# EAGLE design Lamp Logic Board_3 (EAGLE 9.4.2)

## Sheet 1 of 4
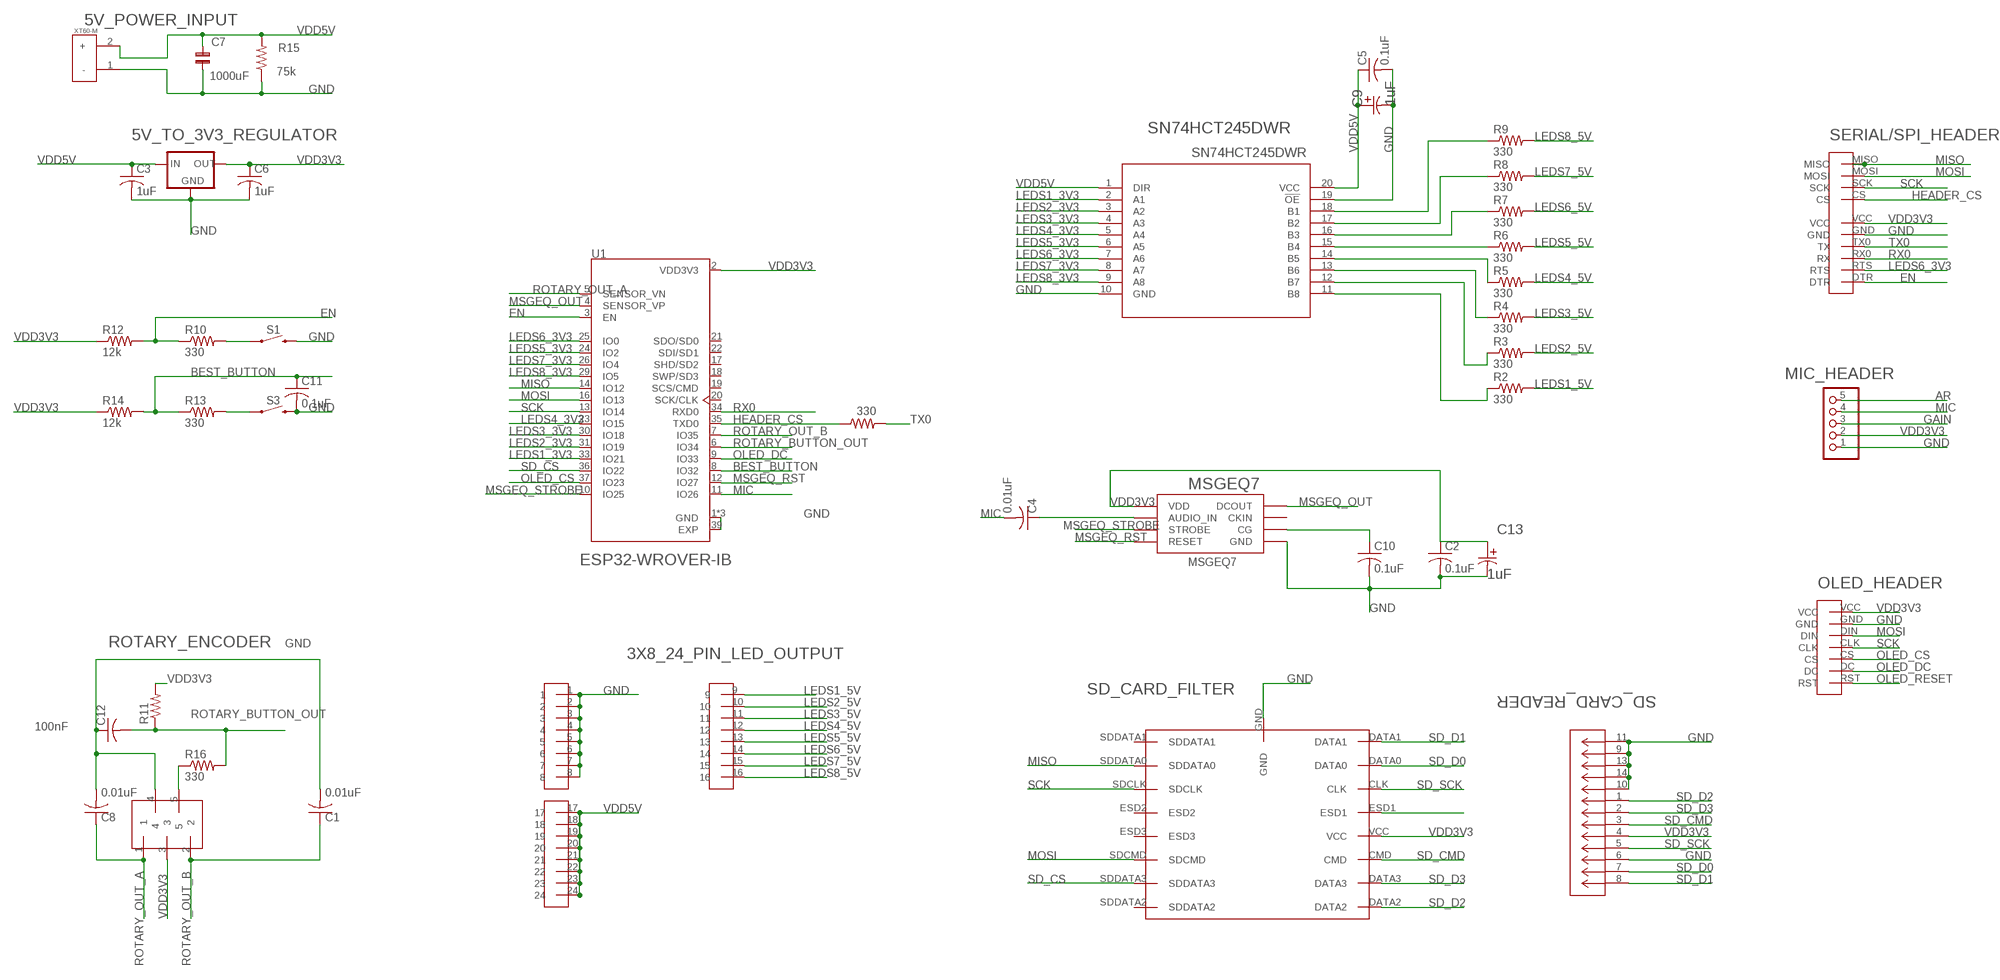
[diagram p0: schematic, sheet 1]

### Parts
3X8_24_PIN_LED_OUTPUT  3X8PINHEAD  [3X8PINHEAD]
5V_POWER_INPUT  XT60-M  [AMASS_XT60-M]
5V_TO_3V3_REGULATOR  LM1117MP-1.8  [SOT223]
C1  0.01uF  C-USC0402  [C0402]
C2  0.1uF  C-USC0805  [C0805]
C3  1uF  C-USC0402  [C0402]
C4  0.01uF  C-USC0402  [C0402]
C5  0.1uF  C-USC0805  [C0805]
C6  1uF  C-USC0402  [C0402]
C7  1000uF  C-BP-2,0X5  [ENP2,0-5]
C8  0.01uF  C-USC0402  [C0402]
C9  1uF  EEEFC1V1R0R  [CAP_EEFC_B]
C10  0.1uF  C-USC0805  [C0805]
C11  0.1uF  C-USC0805  [C0805]
C12  100nF  C-USC0402  [C0402]
C13  1uF  EEEFC1V1R0R  [CAP_EEFC_B]
MIC_HEADER  PINHD-1X5  [1X05]
MSGEQ7  MSGEQ7DIL  [DIL-08]
OLED_HEADER  SPIOLED_STANDOFF  [SPIOLED_STADOFF]
R1  330  R-US_R1206  [R1206]
R2  330  R-US_R1206  [R1206]
R3  330  R-US_R1206  [R1206]
R4  330  R-US_R1206  [R1206]
R5  330  R-US_R1206  [R1206]
R6  330  R-US_R1206  [R1206]
R7  330  R-US_R1206  [R1206]
R8  330  R-US_R1206  [R1206]
R9  330  R-US_R1206  [R1206]
R10  330  R-US_R1206  [R1206]
R11  R-US_R0603  [R0603]
R12  12k  R-US_R0603  [R0603]
R13  330  R-US_R1206  [R1206]
R14  12k  R-US_R0603  [R0603]
R15  75k  R-US_0309/12  [0309/12]
R16  330  R-US_R1206  [R1206]
ROTARY_ENCODER  EN11-HSM1AF15  [EN11-HSM]
S1  MOMENTARY-SWITCH-SPST-SMD-6.0X3.5MM  [TACTILE_SWITCH_SMD_6.0X3.5MM]
S3  MOMENTARY-SWITCH-SPST-SMD-12MM  [TACTILE_SWITCH_SMD_12MM]
SD_CARD_FILTER  CM1624-08DE  [CM1624-08DE]
SD_CARD_READER  LLC  [CON00218_8]
SERIAL/SPI_HEADER  2X6PINHEAD  [2X6PINHEAD]
SN74HCT245DWR  SN74HCT245DWR  [DW20]
U1  ESP32-WROVER-IB  ESP32-WROVER-I  [XCVR_ESP32-WROVER-I]

### Nets
AR: MIC_HEADER.5
BEST_BUTTON: C11.1 R13.1 R14.2 U1.8(IO32)
EN: R10.1 R12.2 SERIAL/SPI_HEADER.DTR U1.3(EN)
GAIN: MIC_HEADER.3
GND: 3X8_24_PIN_LED_OUTPUT.1 3X8_24_PIN_LED_OUTPUT.2 3X8_24_PIN_LED_OUTPUT.3 3X8_24_PIN_LED_OUTPUT.4 3X8_24_PIN_LED_OUTPUT.5 3X8_24_PIN_LED_OUTPUT.6 3X8_24_PIN_LED_OUTPUT.7 3X8_24_PIN_LED_OUTPUT.8 5V_POWER_INPUT.1(-) 5V_TO_3V3_REGULATOR.1(GND) C1.2 C2.2 C3.2 C5.2 C6.2 C7.1 C8.2 C9.2 C10.2 C11.2 C12.1 C13.2 MIC_HEADER.1 MSGEQ7.2(GND) OLED_HEADER.GND R15.1 ROTARY_ENCODER.4 S1.2 S3.3 SD_CARD_FILTER.GND SD_CARD_READER.6 SD_CARD_READER.9 SD_CARD_READER.10 SD_CARD_READER.11 SD_CARD_READER.13 SD_CARD_READER.14 SERIAL/SPI_HEADER.GND SN74HCT245DWR.10(GND) SN74HCT245DWR.19(!OE) U1.1(GND) U1.15(GND) U1.38(GND) U1.39(EXP)
HEADER_CS: R1.1 SERIAL/SPI_HEADER.CS U1.35(TXD0)
LEDS1_3V3: SN74HCT245DWR.2(A1) U1.33(IO21)
LEDS1_5V: 3X8_24_PIN_LED_OUTPUT.9 R2.2
LEDS2_3V3: SN74HCT245DWR.3(A2) U1.31(IO19)
LEDS2_5V: 3X8_24_PIN_LED_OUTPUT.10 R3.2
LEDS3_3V3: SN74HCT245DWR.4(A3) U1.30(IO18)
LEDS3_5V: 3X8_24_PIN_LED_OUTPUT.11 R4.2
LEDS4_3V3: SN74HCT245DWR.5(A4) U1.23(IO15)
LEDS4_5V: 3X8_24_PIN_LED_OUTPUT.12 R5.2
LEDS5_3V3: SN74HCT245DWR.6(A5) U1.24(IO2)
LEDS5_5V: 3X8_24_PIN_LED_OUTPUT.13 R6.2
LEDS6_3V3: SERIAL/SPI_HEADER.RTS SN74HCT245DWR.7(A6) U1.25(IO0)
LEDS6_5V: 3X8_24_PIN_LED_OUTPUT.14 R7.2
LEDS7_3V3: SN74HCT245DWR.8(A7) U1.26(IO4)
LEDS7_5V: 3X8_24_PIN_LED_OUTPUT.15 R8.2
LEDS8_3V3: SN74HCT245DWR.9(A8) U1.29(IO5)
LEDS8_5V: 3X8_24_PIN_LED_OUTPUT.16 R9.2
MIC: C4.2 MIC_HEADER.4 U1.11(IO26)
MISO: SD_CARD_FILTER.SDDATA0 SERIAL/SPI_HEADER.MISO U1.14(IO12)
MOSI: OLED_HEADER.DIN SD_CARD_FILTER.SDCMD SERIAL/SPI_HEADER.MOSI U1.16(IO13)
MSGEQ_OUT: MSGEQ7.3(DCOUT) U1.4(SENSOR_VP)
MSGEQ_RST: MSGEQ7.7(RESET) U1.12(IO27)
MSGEQ_STROBE: MSGEQ7.4(STROBE) U1.10(IO25)
N$1: R9.1 SN74HCT245DWR.18(B1)
N$3: C4.1 MSGEQ7.5(AUDIO_IN)
N$4: C10.1 MSGEQ7.6(CG)
N$5: R16.1 ROTARY_ENCODER.5
N$6: R8.1 SN74HCT245DWR.17(B2)
N$7: R13.2 S3.1
N$8: SD_CARD_FILTER.ESD1
N$9: R10.2 S1.1
N$10: R7.1 SN74HCT245DWR.16(B3)
N$11: R6.1 SN74HCT245DWR.15(B4)
N$12: R5.1 SN74HCT245DWR.14(B5)
N$13: R4.1 SN74HCT245DWR.13(B6)
N$14: R3.1 SN74HCT245DWR.12(B7)
N$15: R2.1 SN74HCT245DWR.11(B8)
OLED_CS: OLED_HEADER.CS U1.37(IO23)
OLED_DC: OLED_HEADER.DC U1.9(IO33)
OLED_RESET: OLED_HEADER.RST
ROTARY_BUTTON_OUT: C12.2 R11.1 R16.2 U1.6(IO34)
ROTARY_OUT_A: C8.1 ROTARY_ENCODER.1 U1.5(SENSOR_VN)
ROTARY_OUT_B: C1.1 ROTARY_ENCODER.2 U1.7(IO35)
RX0: SERIAL/SPI_HEADER.RX0(RX) U1.34(RXD0)
SCK: OLED_HEADER.CLK SD_CARD_FILTER.SDCLK SERIAL/SPI_HEADER.SCK U1.13(IO14)
SD_CMD: SD_CARD_FILTER.CMD SD_CARD_READER.3
SD_CS: SD_CARD_FILTER.SDDATA3 U1.36(IO22)
SD_D0: SD_CARD_FILTER.DATA0 SD_CARD_READER.7
SD_D1: SD_CARD_FILTER.DATA1 SD_CARD_READER.8
SD_D2: SD_CARD_FILTER.DATA2 SD_CARD_READER.1
SD_D3: SD_CARD_FILTER.DATA3 SD_CARD_READER.2
SD_SCK: SD_CARD_FILTER.CLK SD_CARD_READER.5
TX0: R1.2 SERIAL/SPI_HEADER.TX0(TX)
VDD3V3: 5V_TO_3V3_REGULATOR.2(OUT) 5V_TO_3V3_REGULATOR.4(OUT) C2.1 C6.1 C13.1 MIC_HEADER.2 MSGEQ7.1(VDD) OLED_HEADER.VCC R11.2 R12.1 R14.1 ROTARY_ENCODER.3 SD_CARD_FILTER.VCC SD_CARD_READER.4 SERIAL/SPI_HEADER.VCC U1.2(VDD3V3)
VDD5V: 3X8_24_PIN_LED_OUTPUT.17 3X8_24_PIN_LED_OUTPUT.18 3X8_24_PIN_LED_OUTPUT.19 3X8_24_PIN_LED_OUTPUT.20 3X8_24_PIN_LED_OUTPUT.21 3X8_24_PIN_LED_OUTPUT.22 3X8_24_PIN_LED_OUTPUT.23 3X8_24_PIN_LED_OUTPUT.24 5V_POWER_INPUT.2(+) 5V_TO_3V3_REGULATOR.3(IN) C3.1 C5.1 C7.2 C9.1 R15.2 SN74HCT245DWR.1(DIR) SN74HCT245DWR.20(VCC)
Unconnected: MSGEQ7.8(CKIN) SD_CARD_FILTER.ESD2 SD_CARD_FILTER.ESD3 SD_CARD_FILTER.SDDATA1 SD_CARD_FILTER.SDDATA2 U1.17(SHD/SD2) U1.18(SWP/SD3) U1.19(SCS/CMD) U1.20(SCK/CLK) U1.21(SDO/SD0) U1.22(SDI/SD1)

## Sheet 2 of 4

## Sheet 3 of 4

## Sheet 4 of 4

## Library data of the parts
3X8_24_PIN_LED_OUTPUT = 3X8PINHEAD:3X8PINHEAD
5V_POWER_INPUT = XT60-M:XT60-M: DC supply; XT60; male; PIN:2; for cable; soldered; 60A; 500V; AVAILABILITY: Unavailable; MF: AMASS; MP: XT60-M; PACKAGE: Package Analog Devices; PRICE: None
5V_TO_3V3_REGULATOR = lm1117:LM1117?-*: 800mA Low-Dropout Linear Regulator Source: http://ww1.microchip.com/downloads/en/DeviceDoc/39760d.pdf; MF: Texas Instruments; MPN: LM1117MP-1.8; OC_FARNELL: 1469053; OC_NEWARK: 41K3467
C1-C6 C8 C10-C12 = resistor:C-US: CAPACITOR, American symbol
C7 = cap-pan40:C-BP: BIPOLAR ELECTROLYTIC
C9 C13 = EEE-FC1V1R0R:EEEFC1V1R0R; MANUFACTURER_PART_NUMBER: EEEFC1V1R0R; VENDOR: Panasonic
MIC_HEADER = pinhead:PINHD-1X5: PIN HEADER
MSGEQ7 = MSGEQ7:MSGEQ7: 7-band graphic equalizer; DESCRIPTION: Seven Band Graphic Equalizer Display Filter; DIGI-KEY_PART_NUMBER: 1568-1544-ND; DIGI-KEY_PURCHASE_URL: https://www.digikey.com/product-detail/en/sparkfun-electronics/DEV-13116/1568-1544-ND/5764478?utm_source=snapeda&utm_medium=aggregator&utm_campaign=symbol; MF: SparkFun Electronics; MP: MSGEQ7; PACKAGE: SOIC-8 Mixed Signal Integration
OLED_HEADER = SPIOLED-STANDOFF:SPIOLED_STANDOFF
R1-R16 = resistor:R-US_: RESISTOR, American symbol
ROTARY_ENCODER = untitled:EN11-HSM1AF15
S1 = SparkFun-Switches:MOMENTARY-SWITCH-SPST: Momentary Switch (Pushbutton) - SPST Normally-open (NO) SPST momentary switches (buttons, pushbuttons). Variants PTH-12MM - 12mm square, through-hole Momentary Pushbutton Switch - 12mm Square <https://www.sparkfun.com/products/9190> (COM-09190) PTH-6.0MM, PTH-6.0MM-KIT - 6.0mm square, through-hole Mini Pushbutton Switch <https://www.sparkfun.com/products/97> (COM-00097) KIT package intended for soldering kit's - only one side of pads' copper is exposed. PTH-RIGHT-ANGLE-KIT - Right-angle, through-hole Right Angle Tactile Button <https://www.sparkfun.com/products/10791> - Used on SparkFun BigTime Watch Kit <https://www.sparkfun.com/products/11734> SMD-12MM - 12mm square, surface-mount Tactile Button - SMD (12mm) <https://www.sparkfun.com/products/12993> (COM-12993) Used on SparkFun PicoBoard <https://www.sparkfun.com/products/11888> SMD-4.5MM - 4.5mm Square Trackball Switch Used on SparkFun Blackberry Trackballer Breakout <https://www.sparkfun.com/products/13169> SMD-4.6MMX2.8MM - 4.60mm x 2.80mm, surface mount Used on SparkFun SAMD21 Mini Breakout <https://www.sparkfun.com/products/13664> SMD-5.2MM, SMD-5.2-REDUNDANT - 5.2mm square, surface-mount Mini Pushbutton Switch - SMD <https://www.sparkfun.com/products/8720> (COM-08720) Used on Arduino Pro Mini <https://www.sparkfun.com/products/11114> REDUNDANT package connects both switch circuits together SMD-6.0X3.5MM - 6.0 x 3.5mm, surface mount Momentary Reset Switch SMD <https://www.sparkfun.com/products/8229> (COM-08229) SMD-6.2MM-TALL - 6.2mm square, surface mount Tactile Button - SMD (6mm) <https://www.sparkfun.com/products/12992> Used on SparkFun Digital Sandbox <https://www.sparkfun.com/products/12651> SMD-RIGHT-ANGLE - Right-angle, surface mount Used on SparkFun Block for Intel® Edison - Arduino <https://www.sparkfun.com/products/13036>; PROD_ID: SWCH-00815; SF_SKU: COM-08229
S3 = SparkFun-Switches:MOMENTARY-SWITCH-SPST: Momentary Switch (Pushbutton) - SPST Normally-open (NO) SPST momentary switches (buttons, pushbuttons). Variants PTH-12MM - 12mm square, through-hole Momentary Pushbutton Switch - 12mm Square <https://www.sparkfun.com/products/9190> (COM-09190) PTH-6.0MM, PTH-6.0MM-KIT - 6.0mm square, through-hole Mini Pushbutton Switch <https://www.sparkfun.com/products/97> (COM-00097) KIT package intended for soldering kit's - only one side of pads' copper is exposed. PTH-RIGHT-ANGLE-KIT - Right-angle, through-hole Right Angle Tactile Button <https://www.sparkfun.com/products/10791> - Used on SparkFun BigTime Watch Kit <https://www.sparkfun.com/products/11734> SMD-12MM - 12mm square, surface-mount Tactile Button - SMD (12mm) <https://www.sparkfun.com/products/12993> (COM-12993) Used on SparkFun PicoBoard <https://www.sparkfun.com/products/11888> SMD-4.5MM - 4.5mm Square Trackball Switch Used on SparkFun Blackberry Trackballer Breakout <https://www.sparkfun.com/products/13169> SMD-4.6MMX2.8MM - 4.60mm x 2.80mm, surface mount Used on SparkFun SAMD21 Mini Breakout <https://www.sparkfun.com/products/13664> SMD-5.2MM, SMD-5.2-REDUNDANT - 5.2mm square, surface-mount Mini Pushbutton Switch - SMD <https://www.sparkfun.com/products/8720> (COM-08720) Used on Arduino Pro Mini <https://www.sparkfun.com/products/11114> REDUNDANT package connects both switch circuits together SMD-6.0X3.5MM - 6.0 x 3.5mm, surface mount Momentary Reset Switch SMD <https://www.sparkfun.com/products/8229> (COM-08229) SMD-6.2MM-TALL - 6.2mm square, surface mount Tactile Button - SMD (6mm) <https://www.sparkfun.com/products/12992> Used on SparkFun Digital Sandbox <https://www.sparkfun.com/products/12651> SMD-RIGHT-ANGLE - Right-angle, surface mount Used on SparkFun Block for Intel® Edison - Arduino <https://www.sparkfun.com/products/13036>; PROD_ID: SWCH-11967; SF_SKU: COM-12993
SD_CARD_FILTER = CM1624-08DE:CM1624-08DE
SD_CARD_READER = 5027740891:LLC; MANUFACTURER_PART_NUMBER: LLC; VENDOR: Molex Connector Corporation
SERIAL/SPI_HEADER = 2X4PINHEAD:2X6PINHEAD
SN74HCT245DWR = SN74HCT245DWR :SN74HCT245DWR; MANUFACTURER_PART_NUMBER: SN74HCT245DWR; VENDOR: Texas Instruments
U1 = ESP32-WROVER-I:ESP32-WROVER-I: Module: combo; GPIO, I2C x2, I2S x2, SDIO, SPI x3, UART x3; U.FL; AVAILABILITY: Unavailable; DESCRIPTION: Module: combo; GPIO, I2C x2, I2S x2, SDIO, SPI x3, UART x3; U.FL; MF: Espressif Systems; MP: ESP32-WROVER-I; PACKAGE: Module Espressif Systems; PRICE: None

## Board
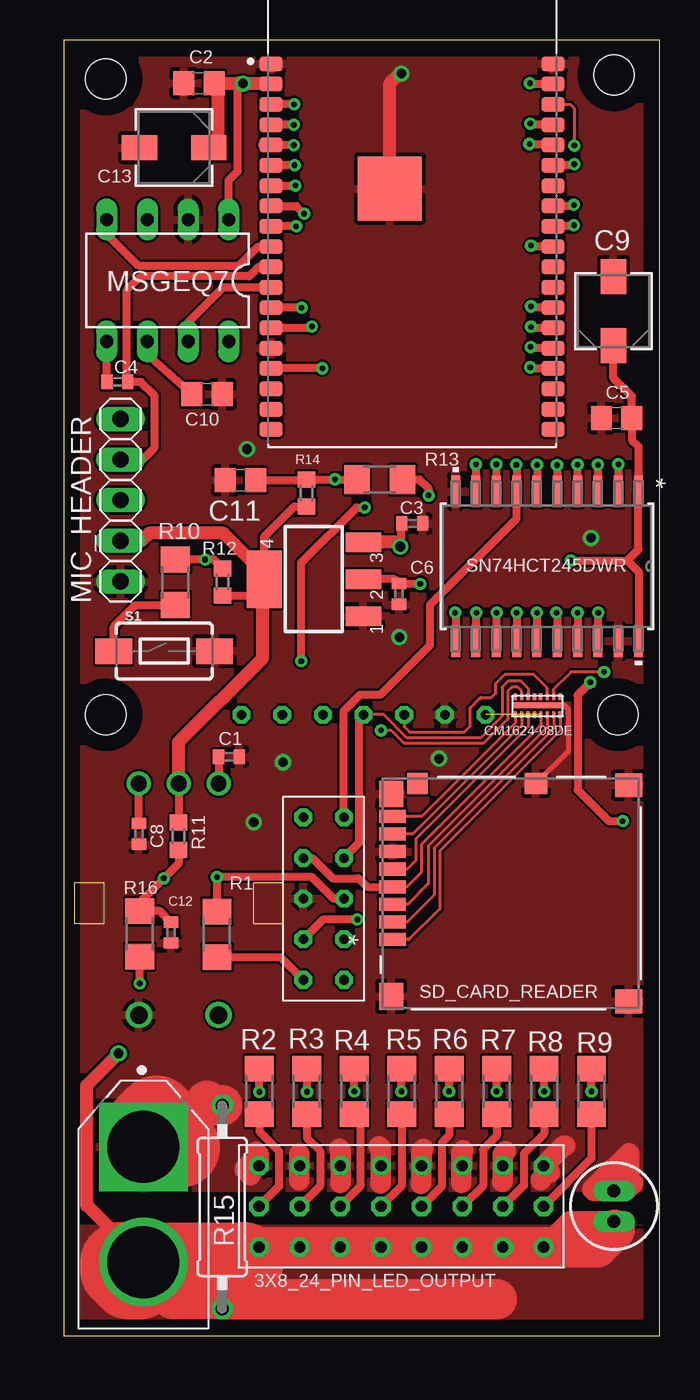
[diagram p1: board, top side]
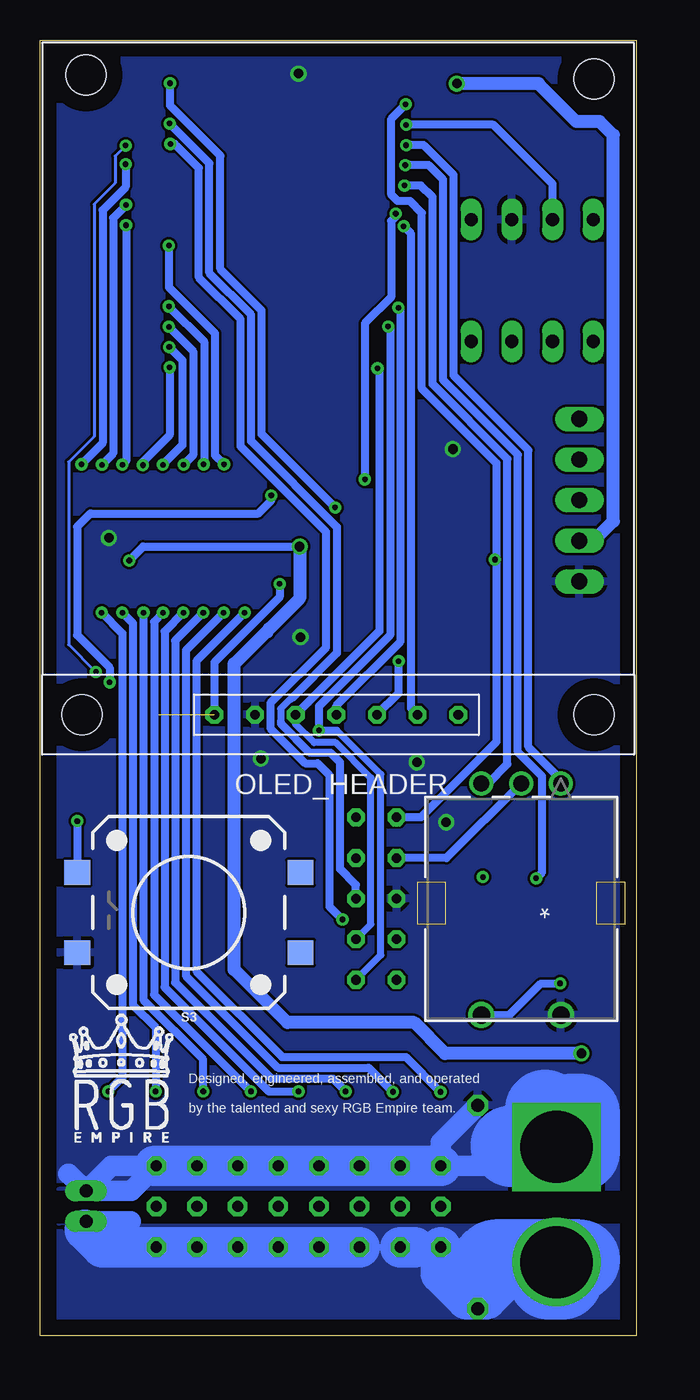
[diagram p2: board, bottom side, seen from below]

Size 37.25 x 81 mm. Coordinates in mm from the lower left corner, seen from the top.
Outline: 0,0 37.25,0 37.25,81 0,81 0,0
Copper layers (1*16): Top 0.035mm / dielectric 1.5mm / Bottom 0.035mm
Design rules "default": minimum track width 6mil, minimum drill 0.35mm, track to track 6mil, track to pad 6mil, pad to pad 6mil, via to via 6mil, smd to smd 6mil, copper to edge 40mil, drill to drill 6mil, minimum pad ring 10mil, minimum via ring 8mil, stop-mask expansion 4mil, vias tented up to drill 0mil, thermal gap 10mil

### Footprints (pad centres in the part's own frame; a part is rotated, then mirrored left to right if it is on the bottom)
3X8PINHEAD = drill 0.7 octagon: 1 0,0; 2 2.54,0; 3 5.08,0; 4 7.62,0; 5 10.16,0; 6 12.7,0; 7 15.24,0; 8 17.78,0; 9 0,-2.54; 10 2.54,-2.54; 11 5.08,-2.54; 12 7.62,-2.54; 13 10.16,-2.54; 14 12.7,-2.54; 15 15.24,-2.54; 16 17.78,-2.54; 17 0,-5.08; 18 2.54,-5.08; 19 5.08,-5.08; 20 7.62,-5.08; 21 10.16,-5.08; 22 12.7,-5.08; 23 15.24,-5.08; 24 17.78,-5.08
AMASS_XT60-M = drill 4.5 square: 1 -3.6,0 | drill 4.5: 2 3.6,0
SOT223 = smd 1.219 x 2.235: 1 -2.311,-3.099; 2 0,-3.099; 3 2.311,-3.099 | smd 3.6 x 2.2: 4 0,3.099
C0402 = smd 0.7 x 0.9: 1 -0.65,0; 2 0.65,0
C0805 = smd 1.3 x 1.5: 1 -0.95,0; 2 0.95,0
ENP2,0-5 = drill 0.813 pad 1.27 long: 1 -0.953,0; 2 0.953,0
CAP_EEFC_B = smd 2.21 x 1.575: 1 -2.159,0; 2 2.159,0
1X05 = drill 1.016 long: 1 -5.08,0; 2 -2.54,0; 3 0,0; 4 2.54,0; 5 5.08,0
DIL-08 = drill 0.813 long: 1 -3.81,-3.81; 2 -1.27,-3.81; 3 1.27,-3.81; 4 3.81,-3.81; 5 3.81,3.81; 6 1.27,3.81; 7 -1.27,3.81; 8 -3.81,3.81
SPIOLED_STADOFF = drill 0.6 octagon: CLK 18.39,2.5; CS 20.93,2.5; DC 23.47,2.5; DIN 15.85,2.5; GND 13.31,2.5; RST 26.01,2.5; VCC 10.77,2.5 | hole 2.5: 2.5,2.5; 34.5,2.5; 34.5,42.25; 2.75,42.5
R1206 = smd 1.6 x 1.803: 1 -1.422,0; 2 1.422,0
R0603 = smd 1 x 1.1: 1 -0.85,0; 2 0.85,0
0309/12 = drill 0.813 octagon: 1 -6.35,0; 2 6.35,0
EN11-HSM = drill 0.991 pad 1.499: 1 -2.489,7.874; 2 2.489,7.874; 3 0,7.874 | drill 1.092 pad 1.6: 4 -2.489,22.352; 5 2.489,22.352
TACTILE_SWITCH_SMD_6.0X3.5MM = smd 2.3 x 1.6: 1 -3.15,0; 2 3.15,0
TACTILE_SWITCH_SMD_12MM = smd 1.6 x 1.55: 1 6.975,-2.5; 2 -6.975,-2.5; 3 6.975,2.5; 4 -6.975,2.5
CM1624-08DE = smd 0.2 x 0.4: CLK 1,0; CMD 2.2,0; DATA0 0.6,0; DATA1 0.2,0; DATA2 3,0; DATA3 2.6,0; ESD1 1.4,0; ESD2 1.4,1.125; ESD3 1.775,1.125; SDCLK 1,1.125; SDCMD 2.2,1.125; SDDATA0 0.6,1.125; SDDATA1 0.2,1.125; SDDATA2 3,1.125; SDDATA3 2.6,1.125; VCC 1.8,0 | smd 3 x 0.35: GND 1.575,0.575
CON00218_8 = smd 0.813 x 1.676: 1 2.899,-7.387; 2 1.799,-7.387; 3 0.699,-7.387; 4 -0.401,-7.387; 5 -1.501,-7.387; 6 -2.601,-7.387; 7 -3.701,-7.387; 8 -4.801,-7.387 | smd 1.499 x 1.702: 9 -6.751,7.374; 10 6.751,7.374 | smd 1.295 x 1.397: 11 -6.859,1.577 | smd 1.295 x 1.295: 12 -6.859,-5.823 | smd 1.6 x 1.499: 13 -6.201,-7.476 | smd 1.702 x 1.499: 14 6.449,-7.476
2X6PINHEAD = drill 0.6 octagon: CS 6.35,3.81; DTR 1.27,1.27; GND 6.35,1.27; MISO 11.43,3.81; MOSI 8.89,3.81; RTS 1.27,3.81; RX0 8.89,1.27; SCK 3.81,3.81; TX0 11.43,1.27; VCC 3.81,1.27
DW20 = smd 1.981 x 0.559: 1 -4.686,5.715; 2 -4.686,4.445; 3 -4.686,3.175; 4 -4.686,1.905; 5 -4.686,0.635; 6 -4.686,-0.635; 7 -4.686,-1.905; 8 -4.686,-3.175; 9 -4.686,-4.445; 10 -4.686,-5.715; 11 4.686,-5.715; 12 4.686,-4.445; 13 4.686,-3.175; 14 4.686,-1.905; 15 4.686,-0.635; 16 4.686,0.635; 17 4.686,1.905; 18 4.686,3.175; 19 4.686,4.445; 20 4.686,5.715
XCVR_ESP32-WROVER-I = smd 1.45 x 0.93: 1 -8.81,8.26; 2 -8.81,6.99; 3 -8.81,5.72; 4 -8.81,4.45; 5 -8.81,3.18; 6 -8.81,1.91; 7 -8.81,0.64; 8 -8.81,-0.63; 9 -8.81,-1.9; 10 -8.81,-3.17; 11 -8.81,-4.44; 12 -8.81,-5.71; 13 -8.81,-6.98; 14 -8.81,-8.25; 15 -8.81,-9.52; 16 -8.81,-10.79; 17 -8.81,-12.06; 18 -8.81,-13.33; 19 -8.81,-14.6; 20 8.81,-14.6; 21 8.81,-13.33; 22 8.81,-12.06; 23 8.81,-10.79; 24 8.81,-9.52; 25 8.81,-8.25; 26 8.81,-6.98; 27 8.81,-5.71; 28 8.81,-4.44; 29 8.81,-3.17; 30 8.81,-1.9; 31 8.81,-0.63; 32 8.81,0.64; 33 8.81,1.91; 34 8.81,3.18; 35 8.81,4.45; 36 8.81,5.72; 37 8.81,6.99; 38 8.81,8.26 | smd 4 x 4: 39 -1.38,0.47

### Placement (x,y rotation side)
3X8_24_PIN_LED_OUTPUT  12.2,10.62 0 top
5V_POWER_INPUT  4.97,8.2 270 top
5V_TO_3V3_REGULATOR  15.62,47.3 90 top
C1  10.32,36.2 0 top
C2  8.45,78.3 180 top
C3  21.78,50.77 0 top
C4  3.35,59.62 0 top
C5  34.55,57.38 180 top
C6  20.95,46.38 270 top
C7  34.38,8.1 270 top
C8  4.7,31.38 270 top
C9  34.35,64.05 90 top
C10  8.95,58.85 0 top
C11  11.05,53.48 180 top
C12  6.7,25.2 90 top
C13  6.9,74.28 180 top
MIC_HEADER  3.55,52.23 90 top
MSGEQ7  6.5,65.97 180 top
OLED_HEADER  37.12,36.33 0 bottom
R1  9.57,25.1 270 top
R2  12.22,15.28 270 top
R3  15.19,15.28 270 top
R4  18.15,15.28 270 top
R5  21.12,15.28 270 top
R6  24.08,15.28 270 top
R7  27.05,15.28 270 top
R8  30.01,15.28 270 top
R9  32.97,15.28 270 top
R10  6.97,47.1 270 top
R11  7.17,31.23 90 top
R12  9.93,47.12 90 top
R13  19.75,53.52 0 top
R14  15.17,52.69 90 top
R15  9.9,8.05 270 top
R16  4.75,25.12 90 top
ROTARY_ENCODER  7.18,42.41 180 bottom
S1  6.28,42.8 0 top
S3  27.95,26.45 180 bottom
SD_CARD_FILTER  28.02,38.83 0 top
SD_CARD_READER  27.93,27.66 270 top
SERIAL/SPI_HEADER  13.7,33.67 270 top
SN74HCT245DWR  30.2,48.1 270 top
U1  21.77,71.25 0 top

### Tracks (layer width: path | path; a pad name or v marks a point on that pad's centre or on a via)
BEST_BUTTON  (via drill 0.35)
  Top 0.508: C11.1 15.11,53.48 R14.2 v16.95,53.53 18.32,53.53 R13.1 | U1.8 14.54,70.62 v15.02,70.14
  Bottom 0.508: v15.02,70.14 15.02,69.97 15.31,69.67 15.31,64.92 16.95,63.29 v16.95,53.54 v16.95,53.53
EN  (via drill 0.35)
  Top 0.508: R12.2 9.38,48.52 v8.83,48.52 R10.1 | v14.4,76.97 v14.39,76.97 U1.3
  Bottom 0.508: v14.4,76.97 15.3,76.08 15.3,71.33 14.9,70.92 14.12,70.92 13.38,70.18 13.38,59.2 8.73,54.55 8.73,48.62 v8.83,48.52 8.73,48.42 8.73,37.12 13.45,32.41 SERIAL/SPI_HEADER.DTR
GND  (via drill 0.6)
  Top 0.305: 30,35.02 SD_CARD_READER.11 31.55,36.56 31.55,39.16 31.3,39.41 SD_CARD_FILTER.GND 29.61,39.38
  Top 0.813: U1.39 20.39,78.28 21,78.9 v21.1,78.9
  Top 1.27: 12.04,11.49 12.2,11.33 3X8_24_PIN_LED_OUTPUT.1 11.47,10.62 11.3,10.45 11.3,10.38 11.65,10.03 | 3X8_24_PIN_LED_OUTPUT.3 17.28,11.64 | 17.28,11.64 17.23,11.7 | 3X8_24_PIN_LED_OUTPUT.4 19.82,11.71 | 19.82,11.71 19.68,11.85 | 3X8_24_PIN_LED_OUTPUT.5 22.36,11.59 | 22.36,11.59 22.45,11.68 | 3X8_24_PIN_LED_OUTPUT.6 24.9,11.55 | 24.95,11.6 24.9,11.55 | 27.62,11.53 27.44,11.34 3X8_24_PIN_LED_OUTPUT.7 27.44,9.66 27.4,9.62 | 3X8_24_PIN_LED_OUTPUT.8 31.23,11.88 31.35,11.88 | 3X8_24_PIN_LED_OUTPUT.8 30.38,10.23 30.38,10.18 | 3X8_24_PIN_LED_OUTPUT.8 29.98,9.96 29.79,9.77 29.79,9.72 | C7.1 35.35,10.03 35.35,11.4 34.38,10.43 34.27,10.43 33.01,9.16 33.12,9.05 C7.1 | 3X8_24_PIN_LED_OUTPUT.2 14.72,10.61 | 14.72,9.72 14.72,10.61 | 14.72,11.38 14.72,10.61 | 17.28,11.64 17.3,11.62 17.3,9.58 17.27,9.55 | 19.82,11.71 19.8,11.69 19.8,9.54 19.78,9.52 | 22.36,11.59 22.32,11.55 22.32,9.52 22.31,9.51 | 24.9,11.55 24.82,11.47 24.82,9.57 | C7.1 35.13,9.05 35.6,9.53
  Top 2.54: R15.1 9.22,14.4 8.95,14.68
  Top 5: 7.25,11.75 7.2,11.8 5V_POWER_INPUT.1 4.97,12.95 5.8,13.78
  Bottom 1.27: 3X8_24_PIN_LED_OUTPUT.2 3X8_24_PIN_LED_OUTPUT.3 3X8_24_PIN_LED_OUTPUT.4 3X8_24_PIN_LED_OUTPUT.5 3X8_24_PIN_LED_OUTPUT.6 3X8_24_PIN_LED_OUTPUT.7 | 3X8_24_PIN_LED_OUTPUT.7 3X8_24_PIN_LED_OUTPUT.8 31.55,9.05 C7.1 | R15.1 12.2,12.1 3X8_24_PIN_LED_OUTPUT.1 6.15,10.62 5V_POWER_INPUT.1 | C7.1 32.8,10.62 30.07,10.62 3X8_24_PIN_LED_OUTPUT.7 | C7.1 35.45,10.12 35.48,10.12
  Bottom 2.54: 3X8_24_PIN_LED_OUTPUT.1 30.07,10.62 | 7.3,11.8 5V_POWER_INPUT.1
  Bottom 5: 5V_POWER_INPUT.1 7.75,11.8 7.85,11.9 | 5V_POWER_INPUT.1 4.97,13.4 5.7,14.12 | 5V_POWER_INPUT.1 4.08,12.7 4.08,13.88 3.52,13.88 3.52,11.53
  other vias: 11.45,55.42 13.7,35.85 11.88,32.1 32.95,49.88 20.98,43.67 23.45,36.08
  pour Top (isolate 0.12): 0.05,9.25 40.83,9.25 40.83,82 0.05,82
  pour Bottom: 0,82.65 0,9.3 38.85,9.3 38.85,82.68
HEADER_CS  (via drill 0.35)
  Top 0.508: R1.1 v9.57,28.68 15.5,28.68 16.85,27.32 SERIAL/SPI_HEADER.CS | U1.35 29.23,75.7 v29.15,75.78
  Bottom 0.45: 21.52,39.85 21.62,39.76 21.66,39.76 22.21,39.21 22.21,38.44 22.19,38.42 22.19,38.33
  Bottom 0.508: v29.15,75.78 26.66,73.29 26.66,66.43 24.05,63.82 24.05,55.91 18.71,50.56 18.71,42.67 21.52,39.85 | SERIAL/SPI_HEADER.CS 17.51,28.18 18.5,29.18 18.5,35.85 19.09,36.44 20.39,36.44 22.19,38.25 22.19,38.33
LEDS1_3V3  (via drill 0.35)
  Top 0.508: SN74HCT245DWR.2 v34.65,54.47 v34.66,54.48 | v31.9,73.23 31.82,73.16 U1.33
  Bottom 0.508: v31.9,73.23 31.9,71.81 33.34,70.37 33.34,55.8 v34.66,54.48
LEDS1_5V
  Top 0.508: 3X8_24_PIN_LED_OUTPUT.9 13.45,9.34 13.45,11.55 12.22,12.78 R2.2
LEDS2_3V3  (via drill 0.35)
  Top 0.508: v31.88,70.69 31.8,70.62 U1.31 | v33.38,54.45 SN74HCT245DWR.3
  Bottom 0.508: v31.88,70.69 31.88,70.67 32.67,69.87 32.67,55.15 v33.38,54.45
LEDS2_5V
  Top 0.508: R3.2 15.19,12.39 16.02,11.55 16.02,9.37 3X8_24_PIN_LED_OUTPUT.10
LEDS3_3V3  (via drill 0.35)
  Top 0.508: U1.30 31.8,69.35 v31.88,69.42 | v32.1,54.45 SN74HCT245DWR.4
  Bottom 0.508: v31.88,69.42 31.88,54.67 v32.1,54.45
LEDS3_5V
  Top 0.508: R4.2 18.52,13.48 18.52,9.33 3X8_24_PIN_LED_OUTPUT.11
LEDS4_3V3  (via drill 0.35)
  Top 0.508: U1.23 29.23,60.46 v29.15,60.53 | v30.82,54.42 30.82,52.8 SN74HCT245DWR.5
  Bottom 0.508: v29.15,60.53 29.15,56.3 30.82,54.62 v30.82,54.42
LEDS4_5V
  Top 0.508: 3X8_24_PIN_LED_OUTPUT.12 21.12,9.38 R5.2
LEDS5_3V3  (via drill 0.35)
  Top 0.508: U1.24 29.25,61.73 v29.18,61.8 | v29.57,54.45 29.57,52.8 SN74HCT245DWR.6
  Bottom 0.508: v29.18,61.8 28.35,60.98 28.35,55.67 v29.57,54.45
LEDS5_5V
  Top 0.508: 3X8_24_PIN_LED_OUTPUT.13 23.62,9.35 23.62,12.07 24.08,12.53 R6.2
LEDS6_3V3  (via drill 0.35)
  Top 0.508: U1.25 29.27,63 v29.2,63.08 | 28.27,54.6 v28.27,54.45 28.3,54.43 SN74HCT245DWR.7 28.3,51.09 22.9,45.7 22.9,43.17 19.8,40.08 18.52,40.08 17.51,39.06 SERIAL/SPI_HEADER.RTS
  Bottom 0.508: v29.2,63.08 27.68,61.55 27.68,55.05 v28.27,54.45
LEDS6_5V
  Top 0.508: 3X8_24_PIN_LED_OUTPUT.14 26.2,9.38 26.2,11.65 27.05,12.5 R7.2
LEDS7_3V3  (via drill 0.35)
  Top 0.508: U1.26 29.27,64.27 v29.2,64.34 | v27.02,54.48 SN74HCT245DWR.8
  Bottom 0.508: v29.2,64.34 27,62.15 27,54.5 v27.02,54.48
LEDS7_5V
  Top 0.508: 3X8_24_PIN_LED_OUTPUT.15 28.75,9.39 28.75,11.38 30.01,12.64 R8.2
LEDS8_3V3  (via drill 0.35)
  Top 0.508: U1.29 29.27,68.08 v29.2,68.16 | v25.75,54.48 SN74HCT245DWR.9
  Bottom 0.508: v29.2,68.16 29.2,65.55 26.32,62.67 26.32,55.05 v25.75,54.48
LEDS8_5V
  Top 0.508: 3X8_24_PIN_LED_OUTPUT.16 32.98,11.08 R9.2
MIC
  Top 0.508: MIC_HEADER.4 4.92,54.77 5.67,55.52 5.67,58.77 4.83,59.62 C4.2 3.95,59.67 3.95,65.38 4.81,66.23 11.58,66.23 12.15,66.81 U1.11
MISO  (via drill 0.35)
  Top 0.2: SD_CARD_FILTER.SDDATA0 28.61,40.3 28.36,40.55 28,40.55 27.75,40.3 27.75,38.55 26.23,37.02 21.27,37.02 20.45,37.84 v19.82,37.84
  Top 0.508: 12.98,62.98 U1.14 15.41,63 v15.5,63.09
  Bottom 0.45: SERIAL/SPI_HEADER.MISO 15.95,23.8 15.95,35.09 18.7,37.84 v19.82,37.84
  Bottom 0.508: v19.82,37.84 19.82,39.34 15.38,43.79 15.38,62.97 v15.5,63.09
MOSI  (via drill 0.35)
  Top 0.2: SD_CARD_FILTER.SDCMD 30.21,40.48 29.34,41.35 27.58,41.35 27,40.77 27,40.17 26.73,39.9 26.05,39.9 25.98,39.83 | OLED_HEADER.DIN 21.27,38.08 21.62,37.73 25.02,37.73 25.4,38.1 25.4,39.25 25.98,39.83 | 25.98,39.83 26.05,39.83
  Top 0.508: 12.99,60.5 U1.16 12.97,60.48 v16.16,60.48
  Bottom 0.45: OLED_HEADER.DIN 21.27,38.23 20.12,37.08 18.79,37.08 16.58,34.87 16.58,25.72 SERIAL/SPI_HEADER.MOSI
  Bottom 0.508: 21.27,38.45 OLED_HEADER.DIN 20.48,39.62 16.05,44.05 16.05,60.46 16.06,60.48 v16.16,60.48
MSGEQ_OUT  (via drill 0.35)
  Top 0.508: v14.38,75.7 U1.4
  Bottom 0.508: MSGEQ7.3 5.22,72 8.93,75.7 v14.38,75.7
MSGEQ_RST
  Top 0.508: 7.79,62.19 MSGEQ7.7 7.76,63.35 9.96,65.54 U1.12 13.04,65.62
MSGEQ_STROBE
  Top 0.508: 13.03,68.15 U1.10 12.13,68.08 10.95,66.9 4.66,66.9 2.69,68.88 MSGEQ7.4
N$1  (via drill 0.35)
  Top 0.508: v33.4,45.2 33.38,45.17 SN74HCT245DWR.18 | v32.98,15.28 R9.1 | R9.1
  Bottom 0.508: v33.4,45.2 32.1,43.91 32.1,16.14 v32.98,15.28
N$3
  Top 0.508: C4.1 2.69,59.64 MSGEQ7.5
N$4
  Top 0.508: C10.1 5.22,61.32 MSGEQ7.6
N$5  (via drill 0.35)
  Top 0.508: v4.75,22.02 R16.1
  Bottom 0.508: ROTARY_ENCODER.5 7.92,20.05 5.95,22.02 v4.75,22.02
N$6  (via drill 0.35)
  Top 0.508: SN74HCT245DWR.17 v32.1,45.2 | v30.02,15.28 30.02,16.68 R8.1
  Bottom 0.508: v32.1,45.2 31.45,44.54 31.45,20.7 30.02,19.27 v30.02,15.28
N$7  (via drill 0.35)
  Top 0.508: R13.2 22.23,53.52 22.8,52.95 v22.8,52.52 | v32.9,40.85 32.9,40.84 32.1,40.04 32.1,34.13 34.06,32.17 v34.92,32.17
  Bottom 0.508: v32.9,40.85 32.9,41.77 34.92,43.79 34.92,50.58 34.1,51.4 23.6,51.4 22.8,52.2 v22.8,52.52 | v34.92,32.17 S3.1
N$9
  Top 0.508: 3.38,43.05 S1.1 | 2.83,43.1 S1.1 | S1.1 3.12,44.33 4.48,45.68 R10.2
N$10  (via drill 0.35)
  Top 0.508: 30.82,43.4 SN74HCT245DWR.16 30.84,45.15 v30.79,45.2 | v27.05,15.28 R7.1
  Bottom 0.508: v30.78,45.2 v30.79,45.2 30.79,44.81 30.78,44.81 30.78,21.01 27.05,17.27 v27.05,15.28
N$11  (via drill 0.35)
  Top 0.508: 29.57,43.4 SN74HCT245DWR.15 v29.57,45.2 | v24.07,15.28 R6.1
  Bottom 0.508: v29.57,45.2 30.12,44.64 30.12,21.32 v24.07,15.28
N$12  (via drill 0.35)
  Top 0.508: SN74HCT245DWR.14 v28.3,45.2 | v21.1,15.28 21.1,16.68 R5.1
  Bottom 0.508: v28.3,45.2 29.46,44.03 29.46,21.79 22.95,15.28 v21.1,15.28
N$13  (via drill 0.35)
  Top 0.508: SN74HCT245DWR.13 27.02,45.17 v27.05,45.2 | v18.15,15.28 R4.1
  Bottom 0.508: v27.05,45.2 28.8,43.45 28.8,22.09 22.79,16.07 18.95,16.07 v18.15,15.28
N$14  (via drill 0.35)
  Top 0.508: 25.77,43.39 SN74HCT245DWR.12 25.75,45.17 v25.78,45.2 | v15.2,15.25 15.2,16.69 R3.1
  Bottom 0.508: v25.78,45.2 28.14,42.84 28.14,22.51 22.39,16.76 16.71,16.76 v15.2,15.25
N$15  (via drill 0.35)
  Top 0.508: SN74HCT245DWR.11 24.48,45.17 v24.46,45.2 | v12.22,15.25 R2.1
  Bottom 0.508: v24.46,45.2 27.48,42.18 27.48,22.79 22.12,17.42 14.39,17.42 v12.22,15.25
OLED_CS  (via drill 0.35)
  Top 0.508: v29.12,78.3 29.18,78.24 U1.37 | v18.81,51.78 18.3,51.78 14.84,48.32 v14.84,42.17
  Bottom 0.508: v29.12,78.3 29.12,76.9 25.98,73.75 25.98,66.68 23.39,64.1 23.39,56.36 v18.81,51.78 | OLED_HEADER.CS 14.84,40.18 v14.84,42.17
OLED_DC  (via drill 0.35)
  Top 0.508: v14.53,69.35 U1.9
  Bottom 0.508: OLED_HEADER.DC 14.05,39.23 14.05,68.88 v14.53,69.35
ROTARY_BUTTON_OUT  (via drill 0.35)
  Top 0.508: R11.1 7.17,29.52 v6.25,28.6 4.75,27.1 R16.2 6,26.55 C12.2 | U1.6 13.02,73.22 13.07,73.17 v14.43,73.17
  Bottom 0.508: v6.25,28.6 5.88,28.98 5.88,34.98 7.38,36.49 7.38,55.08 12.06,59.75 12.06,72.28 12.96,73.17 v14.43,73.17
ROTARY_OUT_A  (via drill 0.35)
  Top 0.508: C8.1 ROTARY_ENCODER.1 | 12.37,74.43 U1.5 13.03,74.5 13.1,74.42 v14.38,74.42
  Bottom 0.508: ROTARY_ENCODER.1 4.7,34.78 6.72,36.81 6.72,55.35 11.4,60.02 11.4,72.55 13.28,74.42 v14.38,74.42
ROTARY_OUT_B  (via drill 0.35)
  Top 0.508: C1.1 ROTARY_ENCODER.2 | 13.3,71.89 U1.7 v14.47,71.9
  Bottom 0.508: ROTARY_ENCODER.2 9.25,34.53 8.05,35.73 8.05,54.8 12.72,59.48 12.72,71.17 13.45,71.9 v14.47,71.9
RX0  (via drill 0.35)
  Top 0.508: U1.34 30.64,74.5 v29.1,74.5 | v18.35,26.02 16.21,26.02 SERIAL/SPI_HEADER.RX0
  Bottom 0.508: v29.1,74.5 28.83,74.5 27.32,73 27.32,66.16 24.71,63.55 24.71,55.59 19.37,50.24 19.37,43.03 22.85,39.55 22.85,37.97 20.66,35.78 19.9,35.78 19.16,35.04 19.16,26.84 v18.35,26.02
SCK  (via drill 0.35)
  Top 0.2: OLED_HEADER.CLK 20,38.83 21.45,37.38 26.05,37.38 27.4,38.73 27.4,40.55 27.78,40.93 28.55,40.93 29.02,40.47 SD_CARD_FILTER.SDCLK
  Top 0.508: 12.97,64.25 U1.13 v14.86,64.27 | SERIAL/SPI_HEADER.SCK 18.48,30.83 18.48,38.56 OLED_HEADER.CLK
  Bottom 0.508: 18.73,38.98 OLED_HEADER.CLK 18.73,39.39 14.72,43.41 14.72,64.12 14.76,64.16 14.76,64.17 v14.86,64.27
SD_CMD
  Top 0.2: SD_CARD_FILTER.CMD 30.21,38.06 22.79,30.63 22.79,28.27 21.49,26.97 SD_CARD_READER.3
SD_CS  (via drill 0.35)
  Top 0.2: SD_CARD_FILTER.SDDATA3 30.61,40.41 31.7,41.5 v33.76,41.5 | U1.36 31.66,76.97 31.9,76.72 v31.9,74.4
  Bottom 0.2: v33.76,41.5 35.46,43.2 35.46,54.62 33.87,56.21 33.87,70.73 32.55,72.05 32.55,73.75 v31.9,74.4
SD_D0
  Top 0.2: SD_CARD_FILTER.DATA0 28.61,38.18 21.8,31.37 SD_CARD_READER.7
SD_D1
  Top 0.2: 20.58,32.43 SD_CARD_READER.8 22.38,32.47 28.21,38.3 SD_CARD_FILTER.DATA1
SD_D2
  Top 0.2: SD_CARD_FILTER.DATA2 31.02,37.84 23.5,30.32 23.5,26.7 21.57,24.77 SD_CARD_READER.1
SD_D3
  Top 0.2: SD_CARD_FILTER.DATA3 30.61,37.96 23.14,30.49 23.14,27.54 21.47,25.87 SD_CARD_READER.2
SD_SCK
  Top 0.2: SD_CARD_FILTER.CLK 29.02,38.08 22,31.06 22,29.73 21.44,29.17 SD_CARD_READER.5
TX0
  Top 0.508: R1.2 13.53,23.68 14.96,22.25 SERIAL/SPI_HEADER.TX0
VDD3V3  (via drill 0.35, 0.6)  (1 unrouted)
  Top 0.2: SD_CARD_FILTER.VCC 29.82,38.18 22.35,30.72 22.35,28.98 21.44,28.07 SD_CARD_READER.4
  Top 0.508: ROTARY_ENCODER.3 R11.2 | 19.07,47.3 5V_TO_3V3_REGULATOR.2 20.68,47.3 C6.1 20.95,47 v22.27,47 | SERIAL/SPI_HEADER.VCC 15.54,29.86 16.8,28.6 18.43,28.6 18.96,28.07 SD_CARD_READER.4 20.65,28.07 | 12.02,46.8 5V_TO_3V3_REGULATOR.4 | 5V_TO_3V3_REGULATOR.4 11.6,46.38 | 5V_TO_3V3_REGULATOR.4 12.48,47.35 | 5V_TO_3V3_REGULATOR.4 12.53,49.95 14.41,51.84 R14.1 | R12.1 12.32,46.27 12.43,46.38 | 10.88,78.3 10.88,72.8 10.3,72.23 MSGEQ7.1
  Top 0.813: U1.2 12.92,78.28 v11.2,78.28 11.18,78.3 10.88,78.3 C2.1 9.53,78.3 9.63,78.2 9.63,74.85 C13.1 | 5V_TO_3V3_REGULATOR.4 12.53,48.37 | 5V_TO_3V3_REGULATOR.4 12.53,47.62 9.97,50.17 5.33,50.17 4.85,49.7 MIC_HEADER.2 | ROTARY_ENCODER.3 7.18,37.11 12.43,42.35 12.43,46.38 12.43,47.2 5V_TO_3V3_REGULATOR.4
  Bottom 0.508: OLED_HEADER.VCC 26.36,42.09 22.27,46.17 v22.27,47 | ROTARY_ENCODER.3 11.85,29.86 SERIAL/SPI_HEADER.VCC
  Bottom 0.813: 3.65,49.7 MIC_HEADER.2 2.65,49.7 1.42,50.92 1.42,75.05 2.27,75.9 3.73,75.9 6.1,78.28 v11.2,78.28
VDD5V  (via drill 0.35, 0.6)
  Top 0.508: 35.9,52.77 SN74HCT245DWR.1 | C9.1 34.35,59.88 35.5,58.73 C5.1 35.5,56 35.9,55.6 35.9,52.77 | v31.68,48.46 35.2,48.46 | 35.2,48.46 35.9,49.16 35.9,52.77 | 35.2,48.46 35.91,47.75 SN74HCT245DWR.20 | C3.1 21.05,50.91 21.05,49.34 v21.03,49.34
  Top 0.813: 5V_TO_3V3_REGULATOR.3 18.85,49.49 | 18.76,49.58 5V_TO_3V3_REGULATOR.3 | v21.03,49.34 20.75,49.61 5V_TO_3V3_REGULATOR.3 | v3.42,17.65 1.42,15.65 1.42,8.15 5V_POWER_INPUT.2
  Top 1.27: C7.2 31.62,7.15 30.02,5.54 3X8_24_PIN_LED_OUTPUT.24
  Top 2.54: 11.24,4.58 3X8_24_PIN_LED_OUTPUT.17 3X8_24_PIN_LED_OUTPUT.18 3X8_24_PIN_LED_OUTPUT.19 3X8_24_PIN_LED_OUTPUT.20 3X8_24_PIN_LED_OUTPUT.21 3X8_24_PIN_LED_OUTPUT.22 3X8_24_PIN_LED_OUTPUT.23 3X8_24_PIN_LED_OUTPUT.24 33.34,5.54 34.42,6.62 | 27.05,2.29 9.97,2.29 9.97,2.33 6.83,2.33
  Top 5: 11.24,4.58 11.22,4.6 5V_POWER_INPUT.2 3.54,4.6 3.52,4.58 3.52,4.11 4.11,3.52 4.7,3.52
  Bottom 0.508: 22.94,43.89 22.94,44.19 | v21.03,49.34 30.8,49.34 v31.68,48.46
  Bottom 0.813: v3.42,17.65 11.95,17.65 13.88,19.57 21.8,19.57 25.12,22.9 25.12,42 22.94,44.19 21.03,46.1 v21.03,49.34
  Bottom 1.27: 31.58,7.15 C7.2 32.77,5.54 27.4,5.54
  Bottom 2.54: 5V_POWER_INPUT.2 7.05,4.6 9.36,2.29 10.59,2.29 12.2,3.9 3X8_24_PIN_LED_OUTPUT.17 | 13.85,5.54 3X8_24_PIN_LED_OUTPUT.18 | 3X8_24_PIN_LED_OUTPUT.19 27.4,5.54 3X8_24_PIN_LED_OUTPUT.24 33.37,5.54 34.45,6.62
  Bottom 5: 9.1,4.5 8.82,4.78 3.52,4.78 3.69,4.6 5V_POWER_INPUT.2 4.97,4.02 5.47,3.52 4.59,3.52
  pour Bottom (isolate 0.12): -0.16,6.75 37.5,6.75 37.5,-0.15 -0.23,-0.15
  pour Top (isolate 0.12): -0.25,6.72 37.48,6.72 37.48,-0.23 -0.12,-0.23

### Text on the board
tNames: CM1624-08DE
bNames: Designed, engineered, assembled, and operated / / by the talented and sexy RGB Empire team.